# Altium project HYDRA_V4_RECOVERY.PrjPcb (part 2 of 2)

## Sheet SAFETY_SWITCH.SchDoc
size B; SheetNumber: 4; SheetTotal: 10
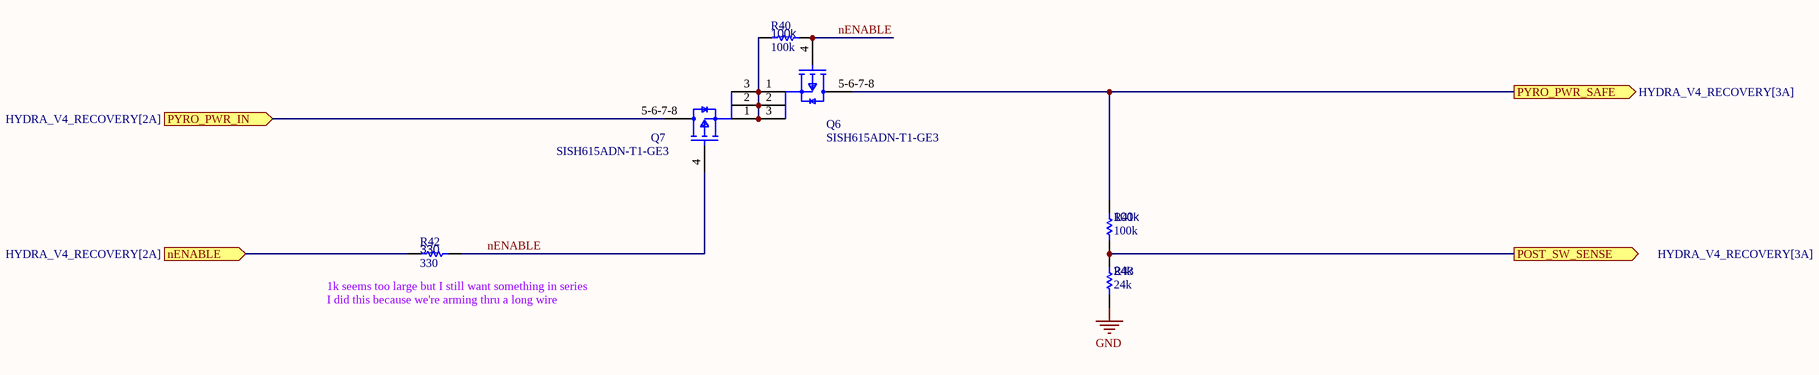
[diagram p9: SAFETY_SWITCH.SchDoc]

### Parts
Q6  SISH615ADN-T1-GE3  [SISH615ADN-T1-GE3-Footprint-1]
Q7  SISH615ADN-T1-GE3  [SISH615ADN-T1-GE3-Footprint-1]
R40  100k  [R0603B]
R41  100k  [R0603B]
R42  330  [R0603B]
R43  24k  [R0603B]

### Ports
nENABLE (in, see HYDRA_V4_RECOVERY[2A]), POST_SW_SENSE (out, see HYDRA_V4_RECOVERY[3A]), PYRO_PWR_IN (in, see HYDRA_V4_RECOVERY[2A]), PYRO_PWR_SAFE (out, see HYDRA_V4_RECOVERY[3A])

### Nets
GND: R43.1
PYRO_PWR_SW: Q6.5-6-7-8(D) R41.2 ; port PYRO_PWR_SAFE
nARM_PYRO: R42.2 ; port nENABLE
nENABLE: Q6.4(G) Q7.4(G) R40.2 R42.1
NetF7_2: Q7.5-6-7-8(D) ; port PYRO_PWR_IN
NetQ6_1: Q6.1(S) Q6.2(S) Q6.3(S) Q7.1(S) Q7.2(S) Q7.3(S) R40.1
NetR41_1: R41.1 R43.2 ; port POST_SW_SENSE

### Notes on the sheet
- (near R42) 1k seems too large but I still want something in series
- (near R42) I did this because we're arming thru a long wire

### Library data of the parts
Q6 Q7 = CMP-013-00018-2: Trans MOSFET P-CH 20V 22.1A 8-Pin PowerPAK 1212 EP T/R; Source: SISH615ADN-T1-GE3.SchLib; Design Item ID: CMP-013-00036-4; Component Type: Standard; Pins: 5
R40-R43 = CMP-009-00002-14: Resistor
  R40 R41: Value: 100k
  R42: Value: 330
  R43: Value: 24k

## Sheet SD.SchDoc
size A; SheetNumber: 10; SheetTotal: 10
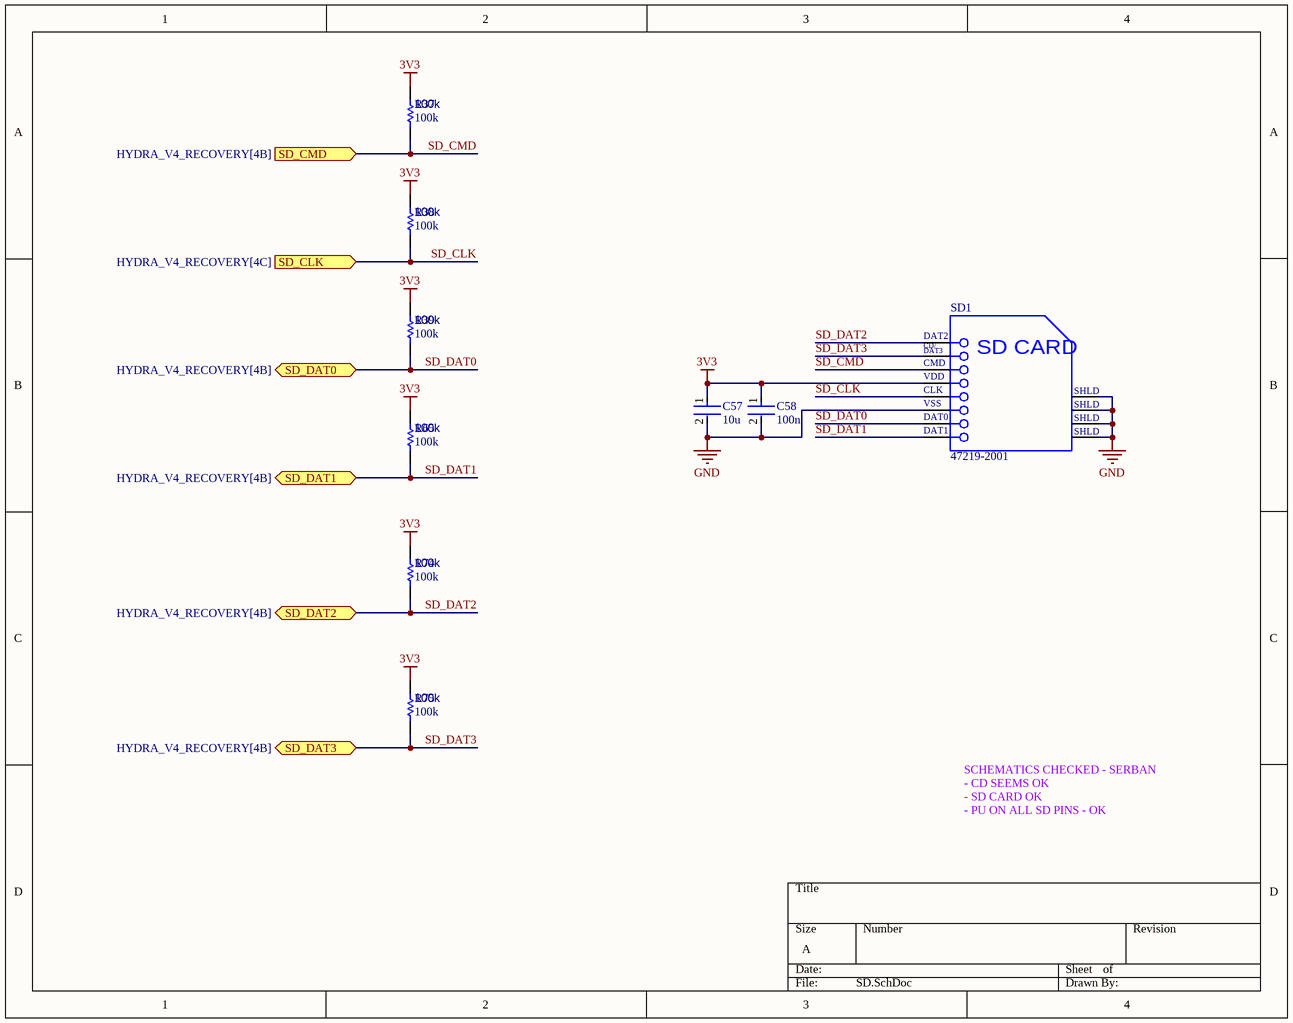
[diagram p10: SD.SchDoc]

### Parts
C57  10u  [FP-0402-L_1_0_0_05-W_0_5-IPC_A]
C58  100n  [FP-0402-L_1_0_0_05-W_0_5-IPC_A]
R37  100k  [R0603B]
R38  100k  [R0603B]
R39  100k  [R0603B]
R65  100k  [R0603B]
R74  100k  [R0603B]
R75  100k  [R0603B]
SD1  47219-2001  [MOLX-47219-2001-8_V]

### Ports
SD_CLK (in, see HYDRA_V4_RECOVERY[4C]), SD_CMD (in, see HYDRA_V4_RECOVERY[4B]), SD_DAT0 (bidir, see HYDRA_V4_RECOVERY[4B]), SD_DAT1 (bidir, see HYDRA_V4_RECOVERY[4B]), SD_DAT2 (bidir, see HYDRA_V4_RECOVERY[4B]), SD_DAT3 (bidir, see HYDRA_V4_RECOVERY[4B])

### Nets
3V3: C57.1 C58.1 R37.1 R38.1 R39.1 R65.1 R74.1 R75.1 SD1.4(VDD)  [project net 3V3_OUT]
GND: C57.2 C58.2 SD1.6(VSS) SD1.9(SHLD) SD1.10(SHLD) SD1.11(SHLD) SD1.12(SHLD)
SD_CLK: R38.2 SD1.5(CLK) ; port SD_CLK
SD_CMD: R37.2 SD1.3(CMD) ; port SD_CMD
SD_DAT0: R39.2 SD1.7(DAT0) ; port SD_DAT0
SD_DAT1: R65.2 SD1.8(DAT1) ; port SD_DAT1
SD_DAT2: R74.2 SD1.1(DAT2) ; port SD_DAT2
SD_DAT3: R75.2 SD1.2(CD/DAT3) ; port SD_DAT3

### Notes on the sheet
- SCHEMATICS CHECKED - SERBAN
  - CD SEEMS OK
  - SD CARD OK
  - PU ON ALL SD PINS - OK
- (in symbol CMP-2000-05245-1) CD/; DAT3; SD CARD

### Library data of the parts
C57 C58 = CMP-001-00058-1: LARGE PADS, 0402 CAP, CHANGE COMMENT TO MATCH REAL P/N; Capacitor Type: Ceramic; Min Operating Temperature: -55°C; Mounting Technology: Surface Mount; Pins: 2; Case/Package: 0402; RoHS Compliant: Yes; Max Operating Temperature: 85°C
  C57: Value: 10u
  C58: Value: 100n
R37-R39 R65 R74 R75 = CMP-009-00002-14: Resistor; Value: 100k
SD1 = CMP-2000-05245-1: MicroSD Card Connector, Hinge Type, -40 to 85 degC, 8-Pin SMD, RoHS, Tape and Reel; Manufacturer: Molex; Current Rating: 500mA; Number of Contacts: 8; Pitch: 1.09mm; Insertion - Extraction Style: Hinged; Voltage Rating: 100VDC; Product: CardConnectors; Contact Material: CopperAlloy; Series: 47219; Packaging: Reel; Brand: Molex; Product Category: MemoryCardConnectors; Housing Material: Thermoplastic; Mounting Style: SMD/SMT; Termination Style: SMD; Datasheet Version: Rev. F, 06/2009; Card Type: microSD; Manufacturer URL: http://www.molex.com/; RoHS: Details; Datasheet URL: http://www.molex.com/pdm_docs/sd/472192001_sd.pdf; Factory Pack Quantity: 2400

## Nets that join several sheets
3V3_OUT: OC_PROT (R31.2 R62.2 U3.10), STM32H730_PINOUT (22 pins), EJECTION_CIRCUIT (8 pins), SENSOR_BANK (10 pins), CAMERA_INTERFACE (11 pins), TCAN330_PINOUT (C51.1 U9.3), TCAN1146_PINOUT (C54.1 U10.5), SD (9 pins)
5V: HYDRA_V4_RECOVERY (D3.1 F3.2 F4.2 LS1.P), OC_PROT (R27.2 U11.10), TCAN1146_PINOUT (C52.1 U10.3)
GND: HYDRA_V4_RECOVERY (49 pins), OC_PROT (22 pins), STM32H730_PINOUT (33 pins), EJECTION_CIRCUIT (20 pins), SENSOR_BANK (18 pins), CAMERA_INTERFACE (24 pins), TCAN330_PINOUT (C51.2 U9.2), TCAN1146_PINOUT (6 pins), SAFETY_SWITCH (R43.1), SD (7 pins)
PYRO_PWR_SW: EJECTION_CIRCUIT (F1.1 F2.1), SAFETY_SWITCH (Q6.5-6-7-8 R41.2)
TCAN1146_VSUP: OC_PROT (F6.2 Q8.2 R23.2), TCAN1146_PINOUT (C53.1 R69.2 U10.10)
BARO_MISO: STM32H730_PINOUT (U8.4), SENSOR_BANK (U4.9 U5.6)
BARO_MOSI: STM32H730_PINOUT (U8.5), SENSOR_BANK (U4.1 U5.7)
BARO_nCS: STM32H730_PINOUT (U8.2), SENSOR_BANK (U5.4 U5.5)
BARO_SCLK: STM32H730_PINOUT (U8.1), SENSOR_BANK (U4.24 U5.8)
CAM_1: HYDRA_V4_RECOVERY (J3.6), CAMERA_INTERFACE (R48.2)
CAM_2: HYDRA_V4_RECOVERY (J4.2), CAMERA_INTERFACE (R50.2)
CAM_SCL: STM32H730_PINOUT (U8.46), CAMERA_INTERFACE (R56.2 U7.28)
CAM_SDA: STM32H730_PINOUT (U8.47), CAMERA_INTERFACE (R58.2 U7.27)
CAN0_N: HYDRA_V4_RECOVERY (J1.16 J6.16), TCAN1146_PINOUT (R70.1 U10.12)
CAN0_P: HYDRA_V4_RECOVERY (J1.15 J6.15), TCAN1146_PINOUT (R70.2 U10.13)
CAN1_N: HYDRA_V4_RECOVERY (J1.20 J6.20), TCAN330_PINOUT (R68.1 U9.6)
CAN1_P: HYDRA_V4_RECOVERY (J1.19 J6.19), TCAN330_PINOUT (R68.2 U9.7)
DROGUE_I_SENSE: STM32H730_PINOUT (U8.31), EJECTION_CIRCUIT (U2.11)
DROGUE_MATCH: HYDRA_V4_RECOVERY (J4.3 J4.4), EJECTION_CIRCUIT (R9.2 U2.3 U2.4)
DROGUE_TRIG: STM32H730_PINOUT (U8.91), EJECTION_CIRCUIT (R14.2 R18.2)
DROGUE_V_SENSE: STM32H730_PINOUT (U8.24), EJECTION_CIRCUIT (R9.1 R12.2)
HS: STM32H730_PINOUT (U8.28), CAMERA_INTERFACE (U7.30)
IMU_nCS: STM32H730_PINOUT (U8.3), SENSOR_BANK (U4.23)
IMU_nRESET: STM32H730_PINOUT (U8.97), SENSOR_BANK (R44.1 U4.18)
IMU_ODR: STM32H730_PINOUT (U8.98), SENSOR_BANK (R45.2 U4.12)
LLC: STM32H730_PINOUT (U8.30), CAMERA_INTERFACE (U7.32)
MAIN_I_SENSE: STM32H730_PINOUT (U8.32), EJECTION_CIRCUIT (U1.11)
MAIN_MATCH: HYDRA_V4_RECOVERY (J3.3 J3.4), EJECTION_CIRCUIT (R1.2 U1.3 U1.4)
MAIN_TRIG: STM32H730_PINOUT (U8.92), EJECTION_CIRCUIT (R6.2 R17.2)
MAIN_V_SENSE: STM32H730_PINOUT (U8.25), EJECTION_CIRCUIT (R1.1 R4.2)
nARM_PYRO: HYDRA_V4_RECOVERY (J5.1), SAFETY_SWITCH (R42.2)
NetF7_2: OC_PROT (F7.2 R25.2), SAFETY_SWITCH (Q7.5-6-7-8)
NetR21_2: HYDRA_V4_RECOVERY (R21.2), STM32H730_PINOUT (U8.29)
NetR23_1: OC_PROT (R23.1 R24.2), STM32H730_PINOUT (U8.15)
NetR25_1: OC_PROT (R25.1 R26.2), STM32H730_PINOUT (U8.23)
NetR27_1: OC_PROT (R27.1 R28.2), STM32H730_PINOUT (U8.18)
NetR31_1: OC_PROT (R31.1 R34.2), STM32H730_PINOUT (U8.22)
NetR33_1: OC_PROT (R33.1 U3.9), STM32H730_PINOUT (U8.34)
NetR41_1: STM32H730_PINOUT (U8.33), SAFETY_SWITCH (R41.1 R43.2)
NetR79_1: OC_PROT (R79.1 U11.9), STM32H730_PINOUT (U8.35)
NetU8_16: STM32H730_PINOUT (U8.16), TCAN1146_PINOUT (U10.11)
NetU8_17: STM32H730_PINOUT (U8.17), TCAN1146_PINOUT (U10.6)
NetU8_51: STM32H730_PINOUT (U8.51), TCAN1146_PINOUT (U10.14)
NetU8_52: STM32H730_PINOUT (U8.52), TCAN1146_PINOUT (U10.8)
NetU8_59: STM32H730_PINOUT (U8.59), TCAN1146_PINOUT (U10.4)
NetU8_60: STM32H730_PINOUT (U8.60), TCAN1146_PINOUT (U10.1)
NetU8_70: STM32H730_PINOUT (U8.70), TCAN330_PINOUT (U9.4)
NetU8_71: STM32H730_PINOUT (U8.71), TCAN330_PINOUT (U9.1)
nINTRQ: STM32H730_PINOUT (U8.69), CAMERA_INTERFACE (R53.2 U7.24)
nPWRDWN: STM32H730_PINOUT (U8.82), CAMERA_INTERFACE (R57.2 U7.31)
nRESET: STM32H730_PINOUT (U8.83), CAMERA_INTERFACE (R55.2 U7.25)
P0: STM32H730_PINOUT (U8.63), CAMERA_INTERFACE (U7.12)
P1: STM32H730_PINOUT (U8.64), CAMERA_INTERFACE (U7.11)
P2: STM32H730_PINOUT (U8.65), CAMERA_INTERFACE (U7.10)
P3: STM32H730_PINOUT (U8.66), CAMERA_INTERFACE (U7.9)
P4: STM32H730_PINOUT (U8.79), CAMERA_INTERFACE (U7.8)
P5: STM32H730_PINOUT (U8.84), CAMERA_INTERFACE (U7.7)
P6: STM32H730_PINOUT (U8.95), CAMERA_INTERFACE (U7.6)
P7: STM32H730_PINOUT (U8.96), CAMERA_INTERFACE (U7.5)
PRE_3V3: HYDRA_V4_RECOVERY (8 pins), OC_PROT (C3.1 R29.1 U3.1 U3.2)
PRE_5V: HYDRA_V4_RECOVERY (8 pins), OC_PROT (C59.1 R76.1 U11.1 U11.2)
PRE_PYRO_PWR: HYDRA_V4_RECOVERY (16 pins), OC_PROT (F7.1)
PRE_VCC: HYDRA_V4_RECOVERY (J1.01 J1.02 J6.01 J6.02), OC_PROT (F6.1)
PRE_ZENER_CAN_INH: OC_PROT (R35.2 R64.2), TCAN1146_PINOUT (U10.7)
SD_CLK: STM32H730_PINOUT (U8.87), SD (R38.2 SD1.5)
SD_CMD: STM32H730_PINOUT (U8.88), SD (R37.2 SD1.3)
SD_DAT0: STM32H730_PINOUT (U8.53), SD (R39.2 SD1.7)
SD_DAT1: STM32H730_PINOUT (U8.54), SD (R65.2 SD1.8)
SD_DAT2: STM32H730_PINOUT (J11.06 U8.89), SD (R74.2 SD1.1)
SD_DAT3: STM32H730_PINOUT (U8.90), SD (R75.2 SD1.2)
VS: STM32H730_PINOUT (U8.93), CAMERA_INTERFACE (U7.29)